# EAGLE design G22V5 (EAGLE 9.6.2)
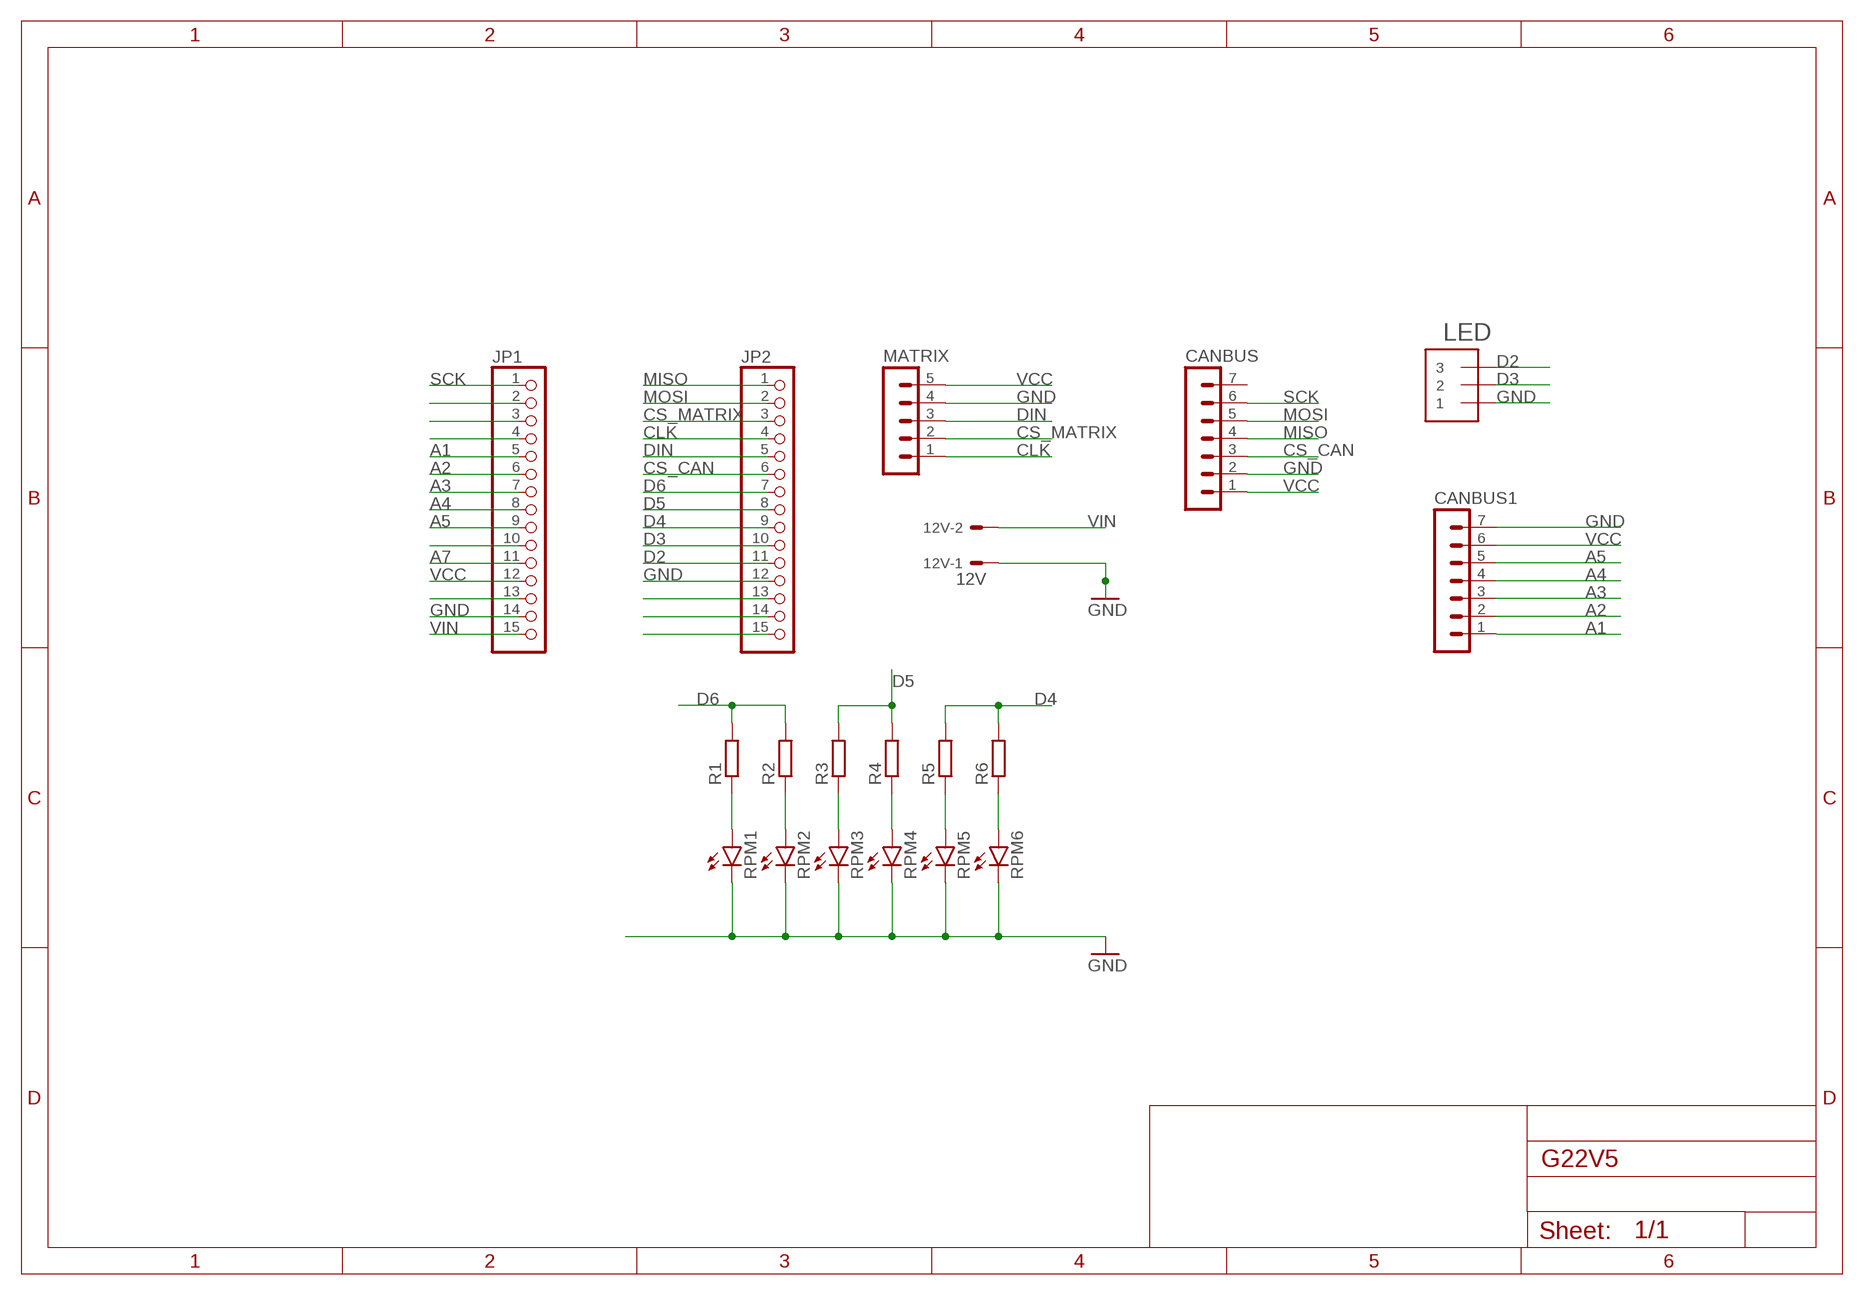
[diagram p0: schematic, sheet 1]

## Parts
12V  12V  22-23-2021  [22-23-2021]
CANBUS  MA07-1  [MA07-1]
CANBUS1  MA07-1  [MA07-1]
JP1  PINHD-1X15  [1X15]
JP2  PINHD-1X15  [1X15]
LED  JST_ZH_3  [JST_ZH_3]
MATRIX  MA05-1  [MA05-1]
R1  R-EU_M0805  [M0805]
R2  R-EU_M0805  [M0805]
R3  R-EU_M0805  [M0805]
R4  R-EU_M0805  [M0805]
R5  R-EU_M0805  [M0805]
R6  R-EU_M0805  [M0805]
RPM1  LED5MM  [LED5MM]
RPM2  LED5MM  [LED5MM]
RPM3  LED5MM  [LED5MM]
RPM4  LED5MM  [LED5MM]
RPM5  LED5MM  [LED5MM]
RPM6  LED5MM  [LED5MM]

## Nets
A1: CANBUS1.1 JP1.5
A2: CANBUS1.2 JP1.6
A3: CANBUS1.3 JP1.7
A4: CANBUS1.4 JP1.8
A5: CANBUS1.5 JP1.9
A7: JP1.11
CLK: JP2.4 MATRIX.1
CS_CAN: CANBUS.3 JP2.6
CS_MATRIX: JP2.3 MATRIX.2
D2: JP2.11 LED.P$3
D3: JP2.10 LED.P$2
D4: JP2.9 R5.2 R6.2
D5: JP2.8 R3.2 R4.2
D6: JP2.7 R1.2 R2.2
DIN: JP2.5 MATRIX.3
GND: 12V.1 CANBUS1.7 CANBUS.2 JP1.14 JP2.12 LED.P$1 MATRIX.4 RPM1.K(C) RPM2.K(C) RPM3.K(C) RPM4.K(C) RPM5.K(C) RPM6.K(C)
MISO: CANBUS.4 JP2.1
MOSI: CANBUS.5 JP2.2
N$1: R1.1 RPM1.A
N$2: R2.1 RPM2.A
N$3: R3.1 RPM3.A
N$4: R4.1 RPM4.A
N$5: R5.1 RPM5.A
N$6: R6.1 RPM6.A
N$13: JP2.13
N$14: JP2.14
N$15: JP2.15
N$17: JP1.2
N$18: JP1.3
N$19: JP1.4
N$25: JP1.10
N$28: JP1.13
SCK: CANBUS.6 JP1.1
VCC: CANBUS1.6 CANBUS.1 JP1.12 MATRIX.5
VIN: 12V.2 JP1.15
Unconnected: CANBUS.7

## Library data of the parts
12V = con-molex:22-23-2021: .100" (2.54mm) Center Header - 2 Pin; MF: MOLEX; MPN: 22-23-2021; OC_FARNELL: 1462926; OC_NEWARK: 25C3832
CANBUS CANBUS1 = con-lstb:MA07-1: PIN HEADER; OC_FARNELL: unknown; OC_NEWARK: unknown
JP1 JP2 = pinhead:PINHD-1X15: PIN HEADER
LED = BeagleBone_Blue_R3:JST_ZH_3
MATRIX = con-lstb:MA05-1: PIN HEADER; OC_FARNELL: unknown; OC_NEWARK: unknown
R1-R6 = rcl:R-EU_: RESISTOR, European symbol; SPICEPREFIX: R
RPM1-RPM6 = led:LED: LED OSRAM: - CHIPLED LG R971, LG N971, LY N971, LG Q971, LY Q971, LO R971, LY R971 LH N974, LH R974 LS Q976, LO Q976, LY Q976 LO Q996 - Hyper CHIPLED LW Q18S LB Q993, LB Q99A, LB R99A - SideLED LS A670, LO A670, LY A670, LG A670, LP A670 LB A673, LV A673, LT A673, LW A673 LH A674 LY A675 LS A676, LA A676, LO A676, LY A676, LW A676 LS A679, LY A679, LG A679 - Hyper Micro SIDELED® LS Y876, LA Y876, LO Y876, LY Y876 LT Y87S - SmartLED LW L88C, LW L88S LB L89C, LB L89S, LG L890 LS L89K, LO L89K, LY L89K LS L896, LA L896, LO L896, LY L896 - TOPLED LS T670, LO T670, LY T670, LG T670, LP T670 LSG T670, LSP T670, LSY T670, LOP T670, LYG T670 LG T671, LOG T671, LSG T671 LB T673, LV T673, LT T673, LW T673 LH T674 LS T676, LA T676, LO T676, LY T676, LB T676, LH T676, LSB T676, LW T676 LB T67C, LV T67C, LT T67C, LS T67K, LO T67K, LY T67K, LW E67C LS E67B, LA E67B, LO E67B, LY E67B, LB E67C, LV E67C, LT E67C LW T67C LS T679, LY T679, LG T679 LS T770, LO T770, LY T770, LG T770, LP T770 LB T773, LV T773, LT T773, LW T773 LH T774 LS E675, LA E675, LY E675, LS T675 LS T776, LA T776, LO T776, LY T776, LB T776 LHGB T686 LT T68C, LB T68C - Hyper Mini TOPLED® LB M676 - Mini TOPLED Santana® LG M470 LS M47K, LO M47K, LY M47K Source: http://www.osram.convergy.de LUXEON: - LUMILED® LXK2-PW12-R00, LXK2-PW12-S00, LXK2-PW14-U00, LXK2-PW14-V00 LXK2-PM12-R00, LXK2-PM12-S00, LXK2-PM14-U00 LXK2-PE12-Q00, LXK2-PE12-R00, LXK2-PE12-S00, LXK2-PE14-T00, LXK2-PE14-U00 LXK2-PB12-K00, LXK2-PB12-L00, LXK2-PB12-M00, LXK2-PB14-N00, LXK2-PB14-P00, LXK2-PB14-Q00 LXK2-PR12-L00, LXK2-PR12-M00, LXK2-PR14-Q00, LXK2-PR14-R00 LXK2-PD12-Q00, LXK2-PD12-R00, LXK2-PD12-S00 LXK2-PH12-R00, LXK2-PH12-S00 LXK2-PL12-P00, LXK2-PL12-Q00, LXK2-PL12-R00 Source: www.luxeon.com KINGBRIGHT: KA-3528ASYC Source: www.kingbright.com

## Board
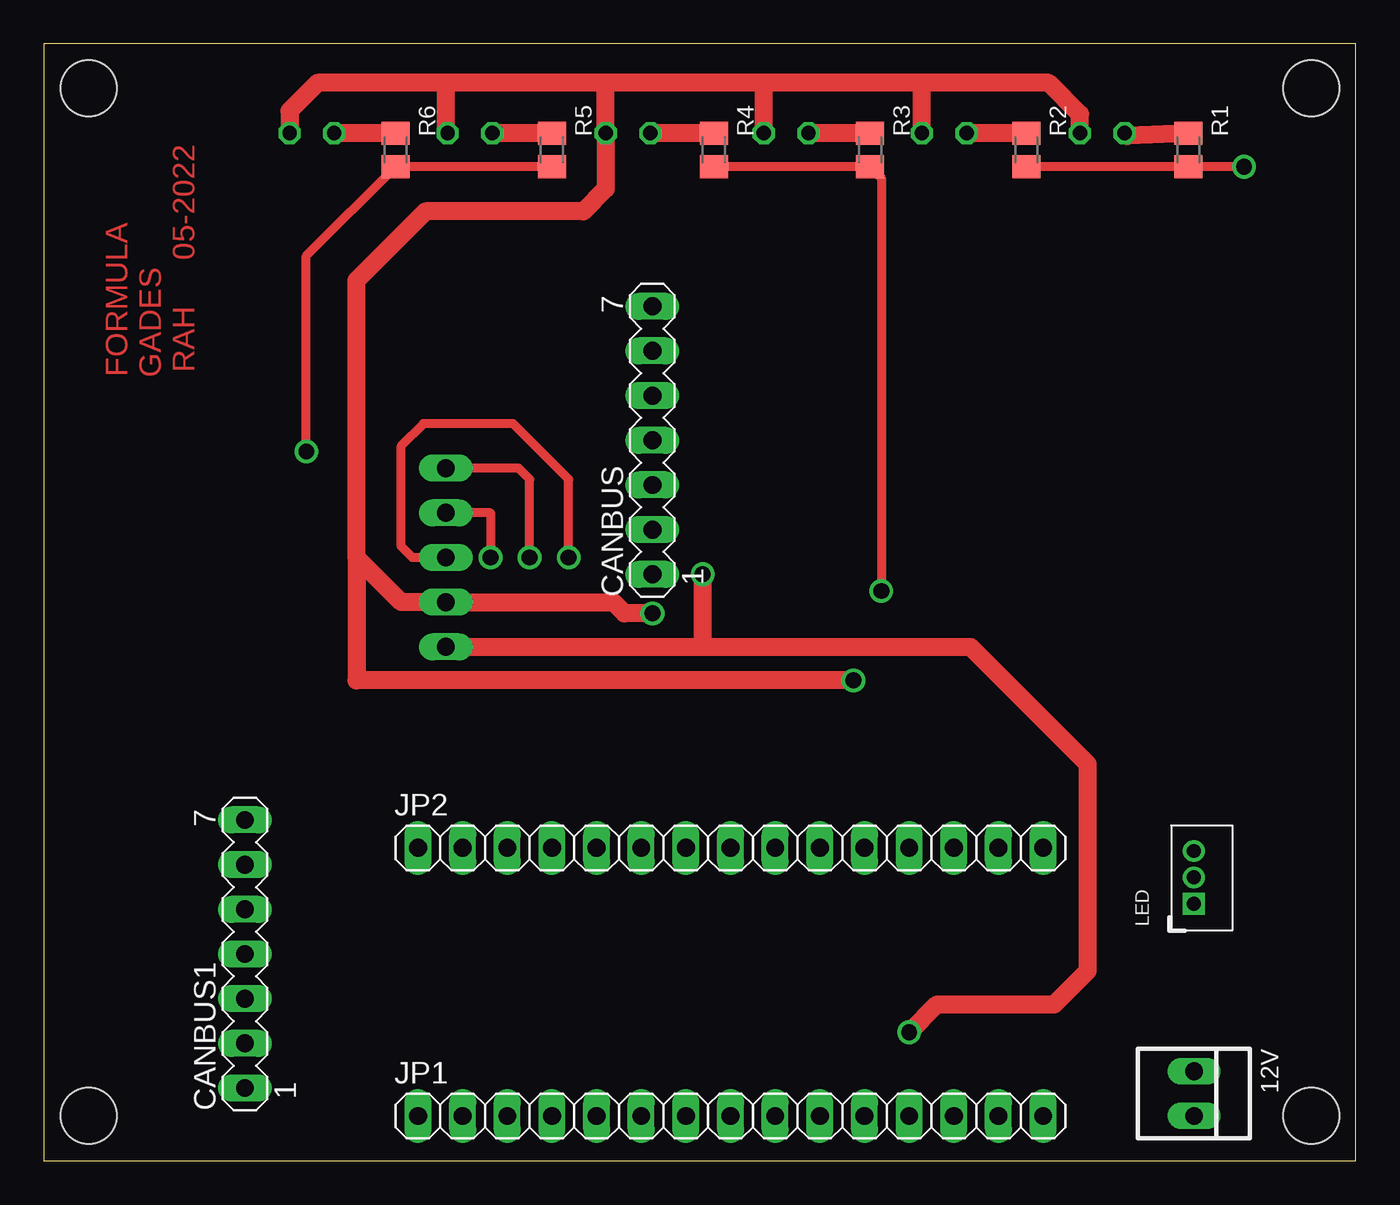
[diagram p1: board, top side]
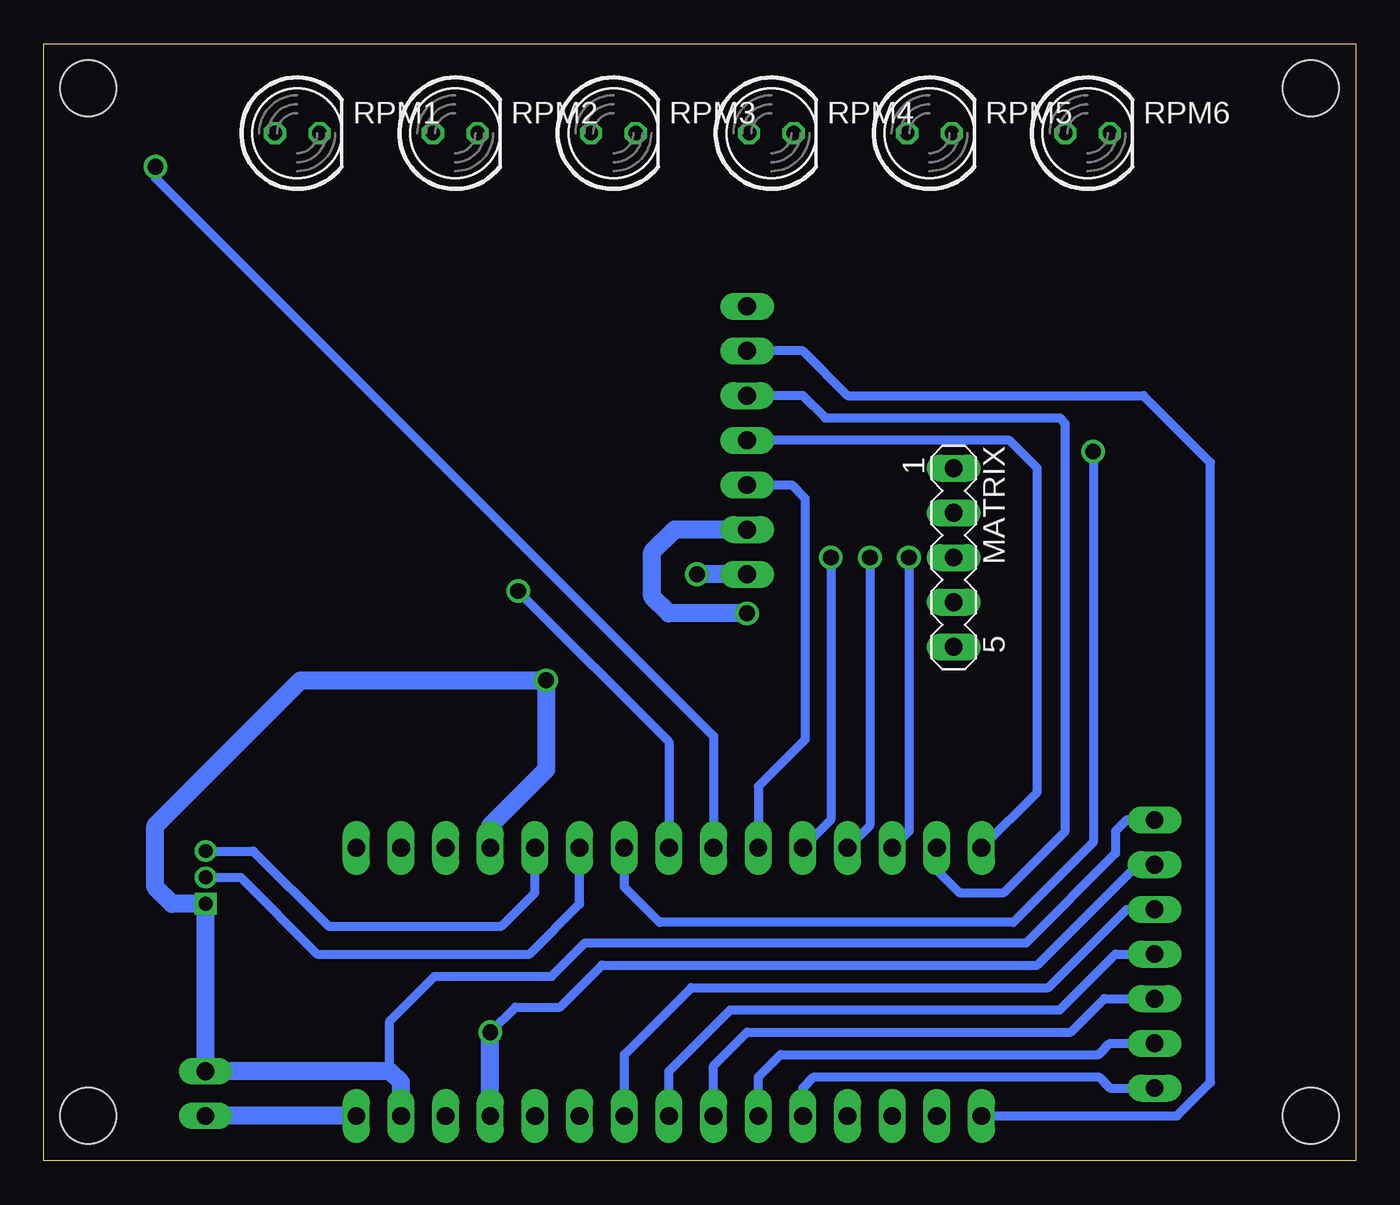
[diagram p2: board, bottom side, seen from below]

Size 74.6 x 63.49 mm. Coordinates in mm from the lower left corner, seen from the top.
Outline: 0,0 74.6,0 74.6,63.49 0,63.49 0,0
Copper layers (1*2+3*4+5*6+7*16): Top 0.035mm / dielectric 0.2mm / layer 2 0.035mm / dielectric 0.15mm / layer 3 0.035mm / dielectric 0.2mm / layer 4 0.035mm / dielectric 0.15mm / layer 5 0.035mm / dielectric 0.2mm / layer 6 0.035mm / dielectric 0.15mm / layer 7 0.035mm / dielectric 0.2mm / Bottom 0.035mm
Design rules "Eagle_WEdirekt_150_check": minimum track width 0.15mm, minimum drill 0.2mm, track to track 0.15mm, track to pad 0.15mm, pad to pad 0.2mm, via to via 0.15mm, smd to smd 0.2mm, copper to edge 0.3mm, drill to drill 0.6mm, minimum pad ring 0.225mm, minimum via ring 0.2mm, stop-mask expansion 0.075mm, vias tented up to drill 0mil, thermal gap 0.3mm
Holes 3.2 mm at 2.54,2.54 2.54,60.96 72.07,60.96 72.07,2.54

### Footprints (pad centres in the part's own frame; a part is rotated, then mirrored left to right if it is on the bottom)
22-23-2021 = drill 1 long: 1 -1.27,0; 2 1.27,0
MA07-1 = drill 1.016 long: 1 -7.62,0; 2 -5.08,0; 3 -2.54,0; 4 0,0; 5 2.54,0; 6 5.08,0; 7 7.62,0
1X15 = drill 1.016 long: 1 -17.78,0; 2 -15.24,0; 3 -12.7,0; 4 -10.16,0; 5 -7.62,0; 6 -5.08,0; 7 -2.54,0; 8 0,0; 9 2.54,0; 10 5.08,0; 11 7.62,0; 12 10.16,0; 13 12.7,0; 14 15.24,0; 15 17.78,0
JST_ZH_3 = drill 0.787 square: P$1 0,0 | drill 0.787: P$2 1.499,0; P$3 2.997,0
MA05-1 = drill 1.016 long: 1 -5.08,0; 2 -2.54,0; 3 0,0; 4 2.54,0; 5 5.08,0
M0805 = smd 1.3 x 1.6: 1 -0.95,0; 2 0.95,0
LED5MM = drill 0.813 octagon: A -1.27,0; K 1.27,0

### Placement (x,y rotation side)
12V  65.41,3.81 270 top
CANBUS  34.61,40.96 90 top
CANBUS1  11.43,11.75 90 top
JP1  39.05,2.54 0 top
JP2  39.05,17.78 0 top
LED  65.41,14.61 90 top
MATRIX  22.86,34.29 270 bottom
R1  65.09,57.47 270 top
R2  55.88,57.47 270 top
R3  46.99,57.47 270 top
R4  38.1,57.47 270 top
R5  28.89,57.47 270 top
R6  20,57.47 270 top
RPM1  60.2,58.42 0 bottom
RPM2  51.21,58.42 0 bottom
RPM3  42.21,58.42 0 bottom
RPM4  33.22,58.42 0 bottom
RPM5  24.23,58.42 0 bottom
RPM6  15.24,58.42 0 bottom

### Tracks (layer width: path | path; a pad name or v marks a point on that pad's centre or on a via)
A1
  Bottom 0.508: JP1.5 31.43,4.13 30.8,4.76 14.61,4.76 13.97,4.13 CANBUS1.1
A2
  Bottom 0.508: JP1.6 33.97,4.76 32.7,6.03 14.61,6.03 13.97,6.67 CANBUS1.2
A3
  Bottom 0.508: JP1.7 36.51,5.4 34.61,7.3 16.19,7.3 14.29,9.21 CANBUS1.3
A4
  Bottom 0.508: JP1.8 39.05,5.08 35.56,8.57 16.83,8.57 13.65,11.75 CANBUS1.4
A5
  Bottom 0.508: JP1.9 41.59,6.03 37.78,9.84 17.46,9.84 13.02,14.29 CANBUS1.5
CLK  (via drill 0.9)
  Top 0.508: MATRIX.1 26.99,39.37 27.62,38.73 v27.62,34.29
  Bottom 0.508: v27.62,34.29 27.62,19.05 JP2.4
CS_CAN
  Bottom 0.508: JP2.6 33.97,21.27 31.31,23.94 31.31,37.66 32.07,38.42 CANBUS.3
CS_MATRIX  (via drill 0.9)
  Top 0.508: v25.4,34.29 25.4,36.83 MATRIX.2
  Bottom 0.508: v25.4,34.29 25.4,18.73 JP2.3
D2
  Bottom 0.508: LED.P$3 62.69,17.6 58.42,13.34 48.58,13.34 46.67,15.24 JP2.11
D3
  Bottom 0.508: LED.P$2 63.41,16.1 59.05,11.75 46.99,11.75 44.13,14.61 JP2.10
D4  (via drill 0.9)
  Top 0.508: v14.92,40.32 14.92,51.44 R6.2 R5.2
  Bottom 0.508: v14.92,40.32 14.92,18.1 19.47,13.55 39.58,13.55 41.59,15.56 JP2.9
D5  (via drill 0.9)
  Top 0.508: v47.62,32.38 47.62,55.88 R3.2 R4.2
  Bottom 0.508: JP2.8 39.05,23.81 v47.62,32.38
D6  (via drill 0.9)
  Top 0.508: v68.26,56.52 R1.2 R2.2
  Bottom 0.508: JP2.7 36.51,24.13 68.26,55.88 v68.26,56.52
DIN  (via drill 0.9)
  Top 0.508: v29.84,34.29 29.84,38.73 26.67,41.91 21.59,41.91 20.32,40.64 20.32,34.92 20.95,34.29 MATRIX.3
  Bottom 0.508: JP2.5 29.84,19.37 v29.84,34.29
GND  (via drill 0.9)
  Top 1.016: RPM1.K 58.93,59.5 57.15,61.28 50.16,61.28 | 50.16,61.28 40.96,61.28 | 40.96,61.28 32.07,61.28 | 32.07,61.28 22.86,61.28 | 22.86,61.28 15.56,61.28 13.97,59.69 RPM6.K | RPM5.K 22.86,58.52 22.86,61.28 | 32.07,61.28 31.95,61.16 RPM4.K 31.95,55.24 30.68,53.98 21.7,53.98 17.78,50.05 17.78,34.29 | RPM3.K 40.95,61.27 40.96,61.28 | RPM2.K 49.94,61.05 50.16,61.28 | 17.78,34.29 20.32,31.75 MATRIX.4 32.38,31.75 33.02,31.11 v34.61,31.11 | 17.78,34.29 17.78,27.3 v46.04,27.3
  Bottom 0.508: CANBUS1.7 13.02,19.37 13.65,18.73 13.65,17.46 18.73,12.38 43.81,12.38 45.72,10.48 52.39,10.48 54.93,7.94 54.93,5.08
  Bottom 1.016: JP1.14 54.29,4.45 54.93,5.08 12V.1 LED.P$1 67.31,14.61 68.26,15.56 68.26,19.05 60.01,27.3 v46.04,27.3 46.04,22.23 49.21,19.05 JP2.12 | CANBUS.2 38.73,35.88 40.01,34.61 40.01,32.07 39.05,31.11 v34.61,31.11
MISO
  Bottom 0.508: JP2.1 18.1,20.95 18.1,39.37 19.68,40.96 CANBUS.4
MOSI
  Bottom 0.508: JP2.2 23.81,16.51 22.54,15.24 20,15.24 16.51,18.73 16.51,41.91 16.83,42.23 30.16,42.23 31.43,43.5 CANBUS.5
N$1
  Top 1.016: R1.1 61.62,58.27 RPM1.A
N$2
  Top 1.016: R2.1 RPM2.A
N$3
  Top 1.016: R3.1 RPM3.A
N$4
  Top 1.016: R4.1 RPM4.A
N$5
  Top 1.016: RPM5.A R5.1
N$6
  Top 1.016: R6.1 RPM6.A
SCK
  Bottom 0.508: CANBUS.6 31.43,46.04 28.89,43.5 12.06,43.5 8.26,39.69 8.26,4.45 10.16,2.54 JP1.1
VCC  (via drill 0.9)
  Top 1.016: v49.21,7.3 50.8,8.89 57.47,8.89 59.37,10.79 59.37,22.54 52.7,29.21 37.47,29.21 | MATRIX.5 37.47,29.21 | v37.47,33.34 37.47,29.21
  Bottom 0.508: CANBUS1.6 12.38,16.83 18.1,11.11 42.86,11.11 45.24,8.73 47.78,8.73 v49.21,7.3
  Bottom 1.016: JP1.12 v49.21,7.3 | CANBUS.1 v37.47,33.34
VIN
  Bottom 1.016: JP1.15 12V.2

### Text on the board
Top: 05-2022 | FORMULA | GADES | RAH